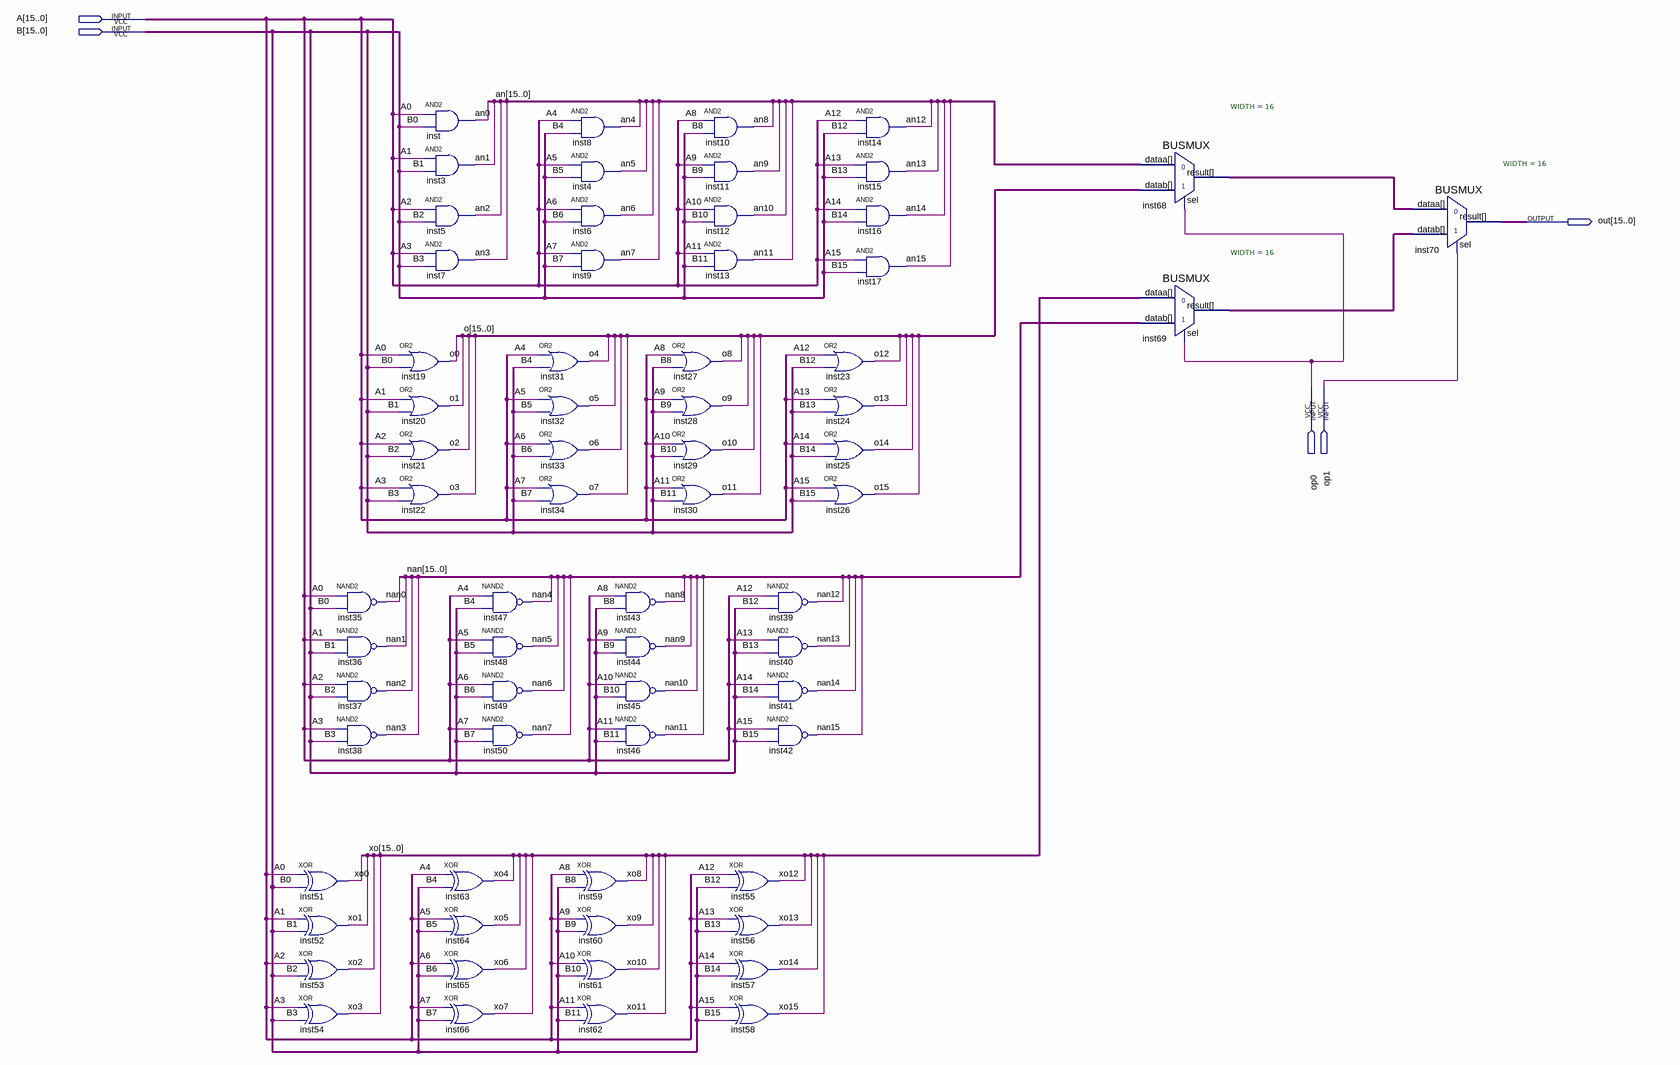
[diagram p0: schematic sheet]
// Quartus schematic lu.bdf as structural Verilog: 67 symbols, 5 pins
module lu (
  input  [15:0] A,
  input  [15:0] B,
  input  op0,
  input  op1,
  output [15:0] out
);

  wire [15:0] an, inst68_result, inst69_result, nan, o, xo;

  nand inst35 (nan[0], A[0], B[0]);
  nand inst36 (nan[1], A[1], B[1]);
  nand inst37 (nan[2], A[2], B[2]);
  nand inst38 (nan[3], A[3], B[3]);
  xor inst51 (xo[0], A[0], B[0]);
  xor inst52 (xo[1], A[1], B[1]);
  xor inst53 (xo[2], A[2], B[2]);
  xor inst54 (xo[3], A[3], B[3]);
  and inst (an[0], A[0], B[0]);
  and inst3 (an[1], A[1], B[1]);
  and inst5 (an[2], A[2], B[2]);
  and inst7 (an[3], A[3], B[3]);
  or inst19 (o[0], A[0], B[0]);
  or inst20 (o[1], A[1], B[1]);
  or inst21 (o[2], A[2], B[2]);
  or inst22 (o[3], A[3], B[3]);
  nand inst47 (nan[4], A[4], B[4]);
  nand inst48 (nan[5], A[5], B[5]);
  nand inst49 (nan[6], A[6], B[6]);
  nand inst50 (nan[7], A[7], B[7]);
  xor inst63 (xo[4], A[4], B[4]);
  xor inst64 (xo[5], A[5], B[5]);
  xor inst65 (xo[6], A[6], B[6]);
  xor inst66 (xo[7], A[7], B[7]);
  or inst31 (o[4], A[4], B[4]);
  or inst32 (o[5], A[5], B[5]);
  or inst33 (o[6], A[6], B[6]);
  or inst34 (o[7], A[7], B[7]);
  and inst8 (an[4], A[4], B[4]);
  and inst4 (an[5], A[5], B[5]);
  and inst6 (an[6], A[6], B[6]);
  and inst9 (an[7], A[7], B[7]);
  xor inst59 (xo[8], A[8], B[8]);
  xor inst60 (xo[9], A[9], B[9]);
  xor inst61 (xo[10], A[10], B[10]);
  xor inst62 (xo[11], A[11], B[11]);
  nand inst43 (nan[8], A[8], B[8]);
  nand inst44 (nan[9], A[9], B[9]);
  nand inst45 (nan[10], A[10], B[10]);
  nand inst46 (nan[11], A[11], B[11]);
  or inst27 (o[8], A[8], B[8]);
  or inst28 (o[9], A[9], B[9]);
  or inst29 (o[10], A[10], B[10]);
  or inst30 (o[11], A[11], B[11]);
  and inst10 (an[8], A[8], B[8]);
  and inst11 (an[9], A[9], B[9]);
  and inst12 (an[10], A[10], B[10]);
  and inst13 (an[11], A[11], B[11]);
  xor inst55 (xo[12], A[12], B[12]);
  xor inst56 (xo[13], A[13], B[13]);
  xor inst57 (xo[14], A[14], B[14]);
  xor inst58 (xo[15], A[15], B[15]);
  nand inst39 (nan[12], A[12], B[12]);
  nand inst40 (nan[13], A[13], B[13]);
  nand inst41 (nan[14], A[14], B[14]);
  nand inst42 (nan[15], A[15], B[15]);
  or inst23 (o[12], A[12], B[12]);
  or inst24 (o[13], A[13], B[13]);
  or inst25 (o[14], A[14], B[14]);
  or inst26 (o[15], A[15], B[15]);
  and inst14 (an[12], A[12], B[12]);
  and inst15 (an[13], A[13], B[13]);
  and inst16 (an[14], A[14], B[14]);
  and inst17 (an[15], A[15], B[15]);
  BUSMUX #(.WIDTH(16)) inst68 (.datab(o), .sel(op0), .dataa(an), .result(inst68_result));
  BUSMUX #(.WIDTH(16)) inst69 (.datab(nan), .sel(op0), .dataa(xo), .result(inst69_result));
  BUSMUX #(.WIDTH(16)) inst70 (.datab(inst69_result), .sel(op1), .dataa(inst68_result), .result(out));
endmodule
